# Altium schematic sheet AMU-S15-V00-BSPDSystem.SchDoc: BSPD System
size A3; DrawnBy: Jonn Dillon; DocumentNumber: 2; Revision: 01; SheetNumber: 13; SheetTotal: 25
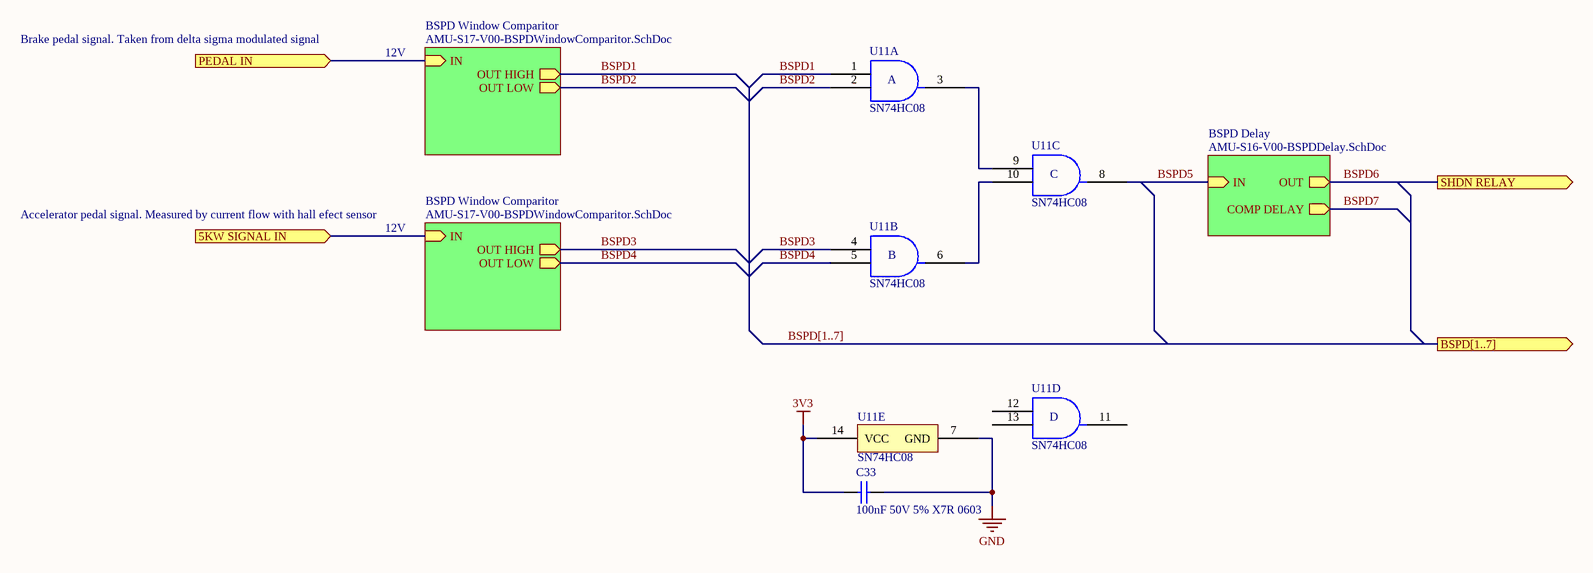
[diagram p0: AMU-S15-V00-BSPDSystem.SchDoc]

## Parts
C33  100nF 50V 5% X7R 0603  [Cap_Ceramic_0603]
U11  SN74HC08  [TSSOP-14]  (parts A,B,C,D,E of 5)

## Sub-sheets
BSPD Delay = AMU-S16-V00-BSPDDelay.SchDoc: OUT (out), IN (in), COMP DELAY (out)
BSPD Window Comparitor = AMU-S17-V00-BSPDWindowComparitor.SchDoc: OUT HIGH (out), IN (in), OUT LOW (out)
BSPD Window Comparitor = AMU-S17-V00-BSPDWindowComparitor.SchDoc: OUT HIGH (out), IN (in), OUT LOW (out)

## Ports
5KW SIGNAL IN (in), BSPD[1..7] (out), PEDAL IN (in), SHDN RELAY (out)

## Nets
3V3: C33.2 U11.14(VCC)
GND: C33.1 U11.7(GND)
5KW SIGNAL IN: port 5KW SIGNAL IN, sheet BSPD Window Comparitor/IN
BSPD1: U11.1(1A) ; sheet BSPD Window Comparitor/OUT HIGH
BSPD2: U11.2(1B) ; sheet BSPD Window Comparitor/OUT LOW
BSPD3: U11.4(2A) ; sheet BSPD Window Comparitor/OUT HIGH
BSPD4: U11.5(2B) ; sheet BSPD Window Comparitor/OUT LOW
BSPD5: U11.8(3Y) ; sheet BSPD Delay/IN
BSPD6: port SHDN RELAY, sheet BSPD Delay/OUT
BSPD7: sheet BSPD Delay/COMP DELAY
PEDAL IN: port PEDAL IN, sheet BSPD Window Comparitor/IN
NetU11_3: U11.3(1Y) U11.9(3A)
NetU11_6: U11.6(2Y) U11.10(3B)

Not connected (* = marked no-connect by the designer): U11 11(4Y) 12(4A) 13(4B)

## Buses and harness runs
bus BSPD[1..7] = port BSPD[1..7]

## Notes on the sheet
- Brake pedal signal. Taken from delta sigma modulated signal
- 12V
- Accelerator pedal signal. Measured by current flow with hall efect sensor
- Revision History:
- Sheet Title:
- Rev
- Date
- Description
- Project:
- Size:
- Drawn By:
- A3
- Number:
- Revision:
- Sheet
- Version:
- of
- QUT Motorsport
- O-120, Gardens Point
- 2 George Street
- Brisbane, QLD 4000
- Australia
- Print Date:
- Print Time:
- File Name:
- (in symbol SN74HC08, part A) A
- (in symbol SN74HC08, part B) B
- (in symbol SN74HC08, part C) C
- (in symbol SN74HC08, part D) D

## Library data of the parts
C33 = 100nF 50V 5% X7R 0603: Capacitor, Ceramic, SMD, 100nF, 50V, 5%, X7R, 0603
U11 = SN74HC08: Quadruple 2-Input Positive-AND Gates